# EAGLE schematic eib-256-nanoz-adapter (EAGLE 6.5.0)
DESIGNER: JPN@MIT; DESIGN_NAME: 2x64_hirose-circular; LICENSE: (c) Jon Newman CC-BY-SA-NC 4.0; REVISION: 1.0
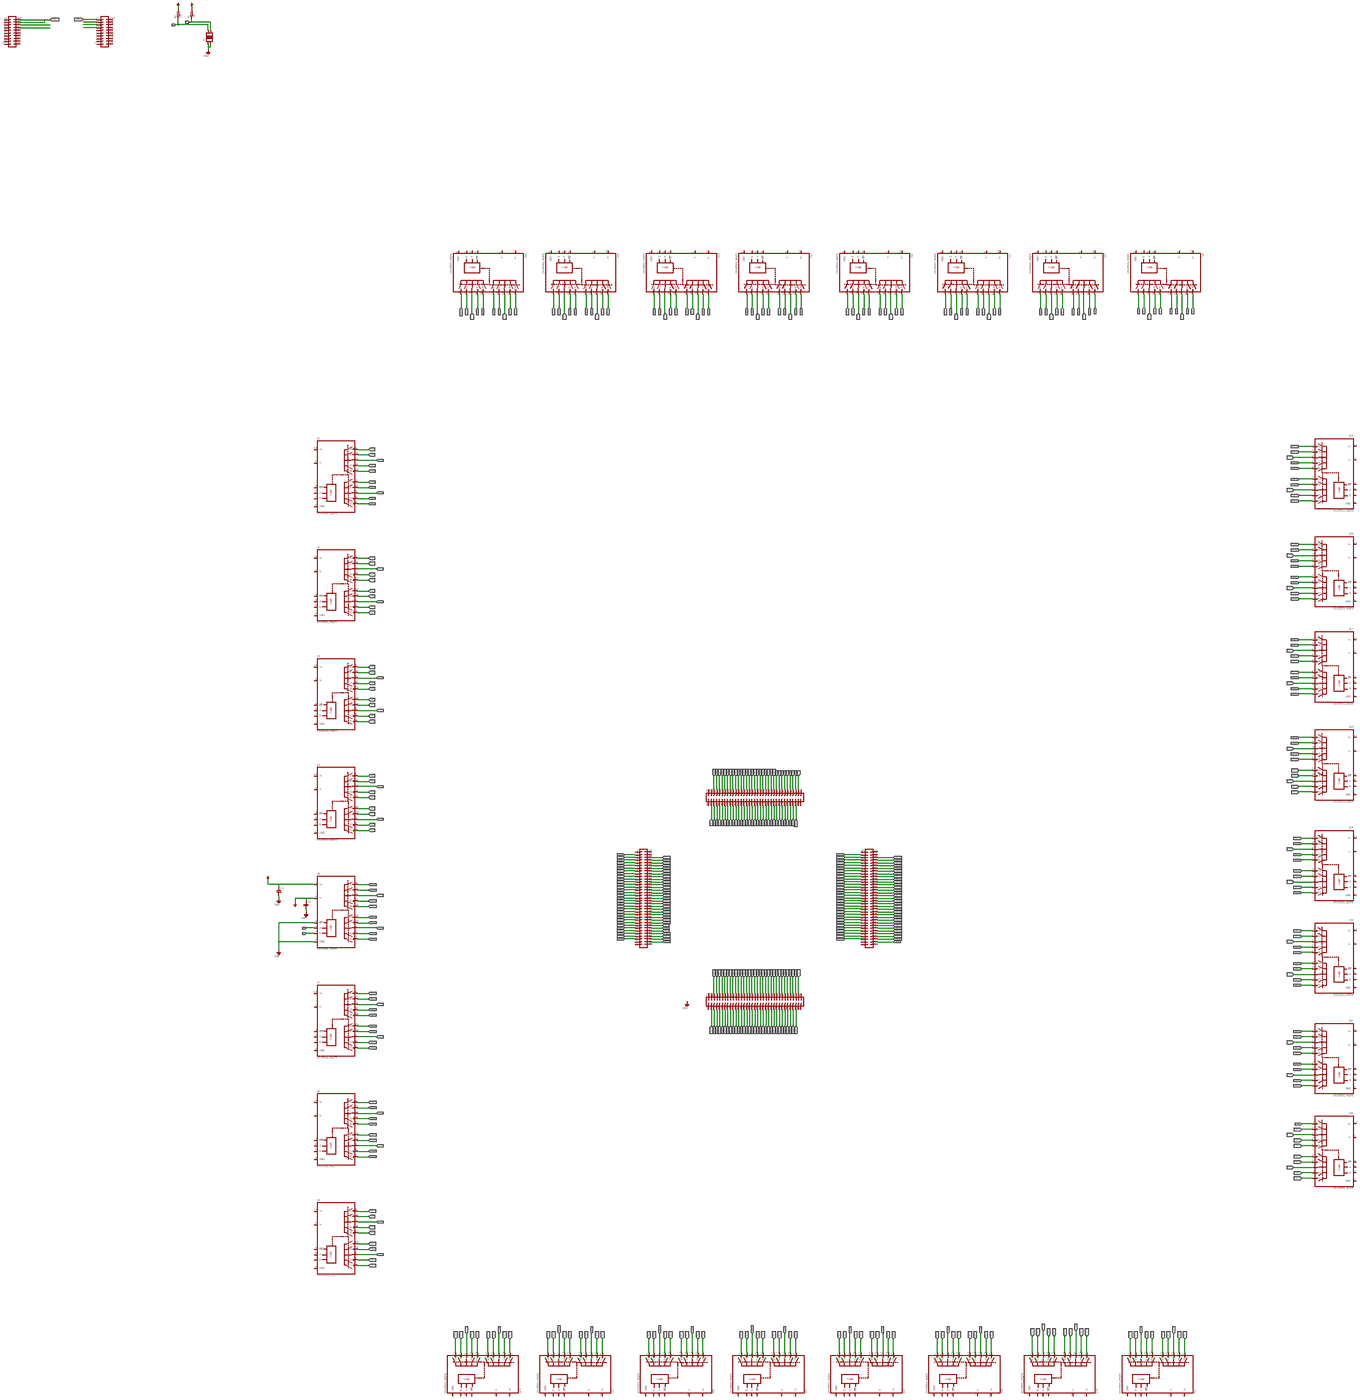
[diagram p0: schematic, sheet 1, overview]
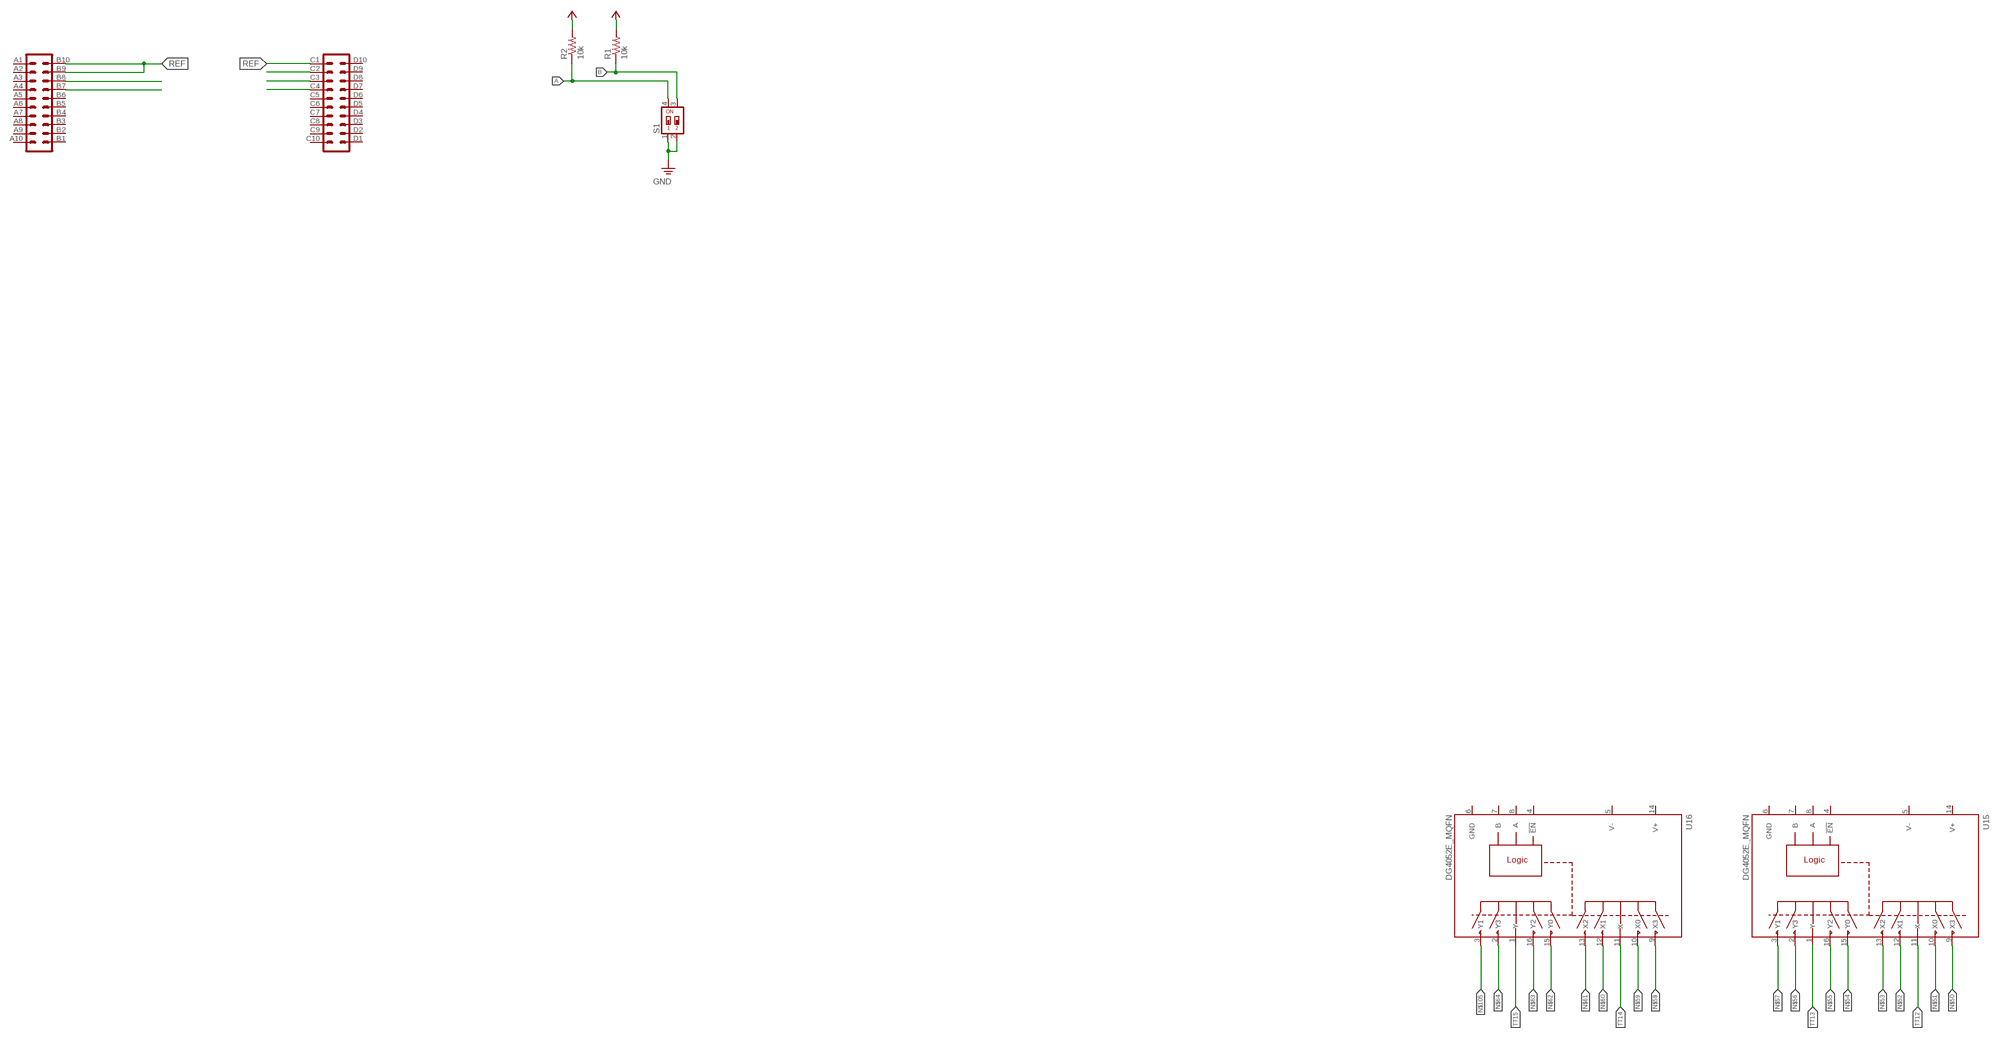
[diagram p1: schematic, sheet 1, part 1 of 8]
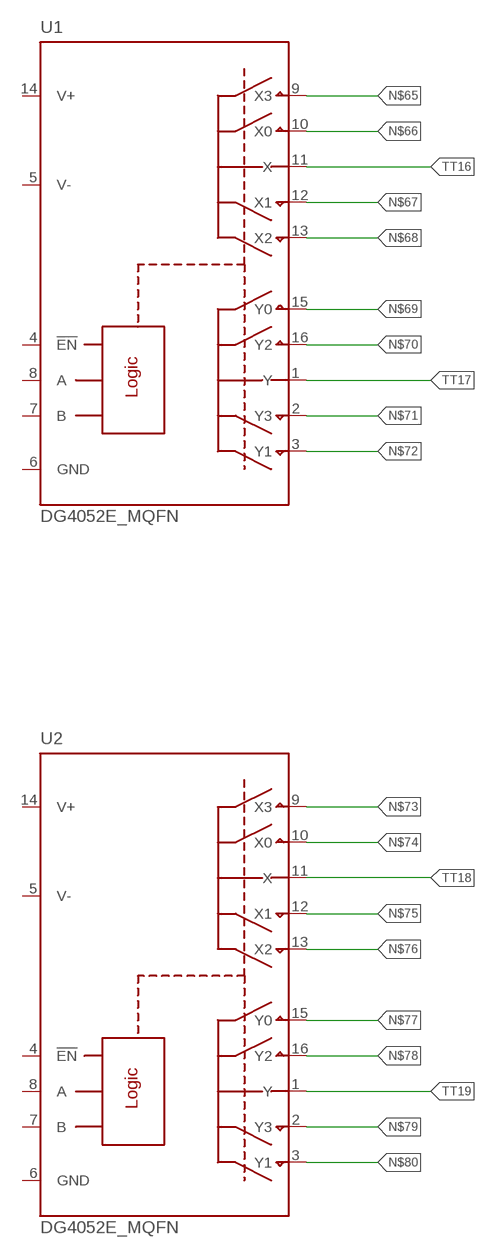
[diagram p2: schematic, sheet 1, part 2 of 8]
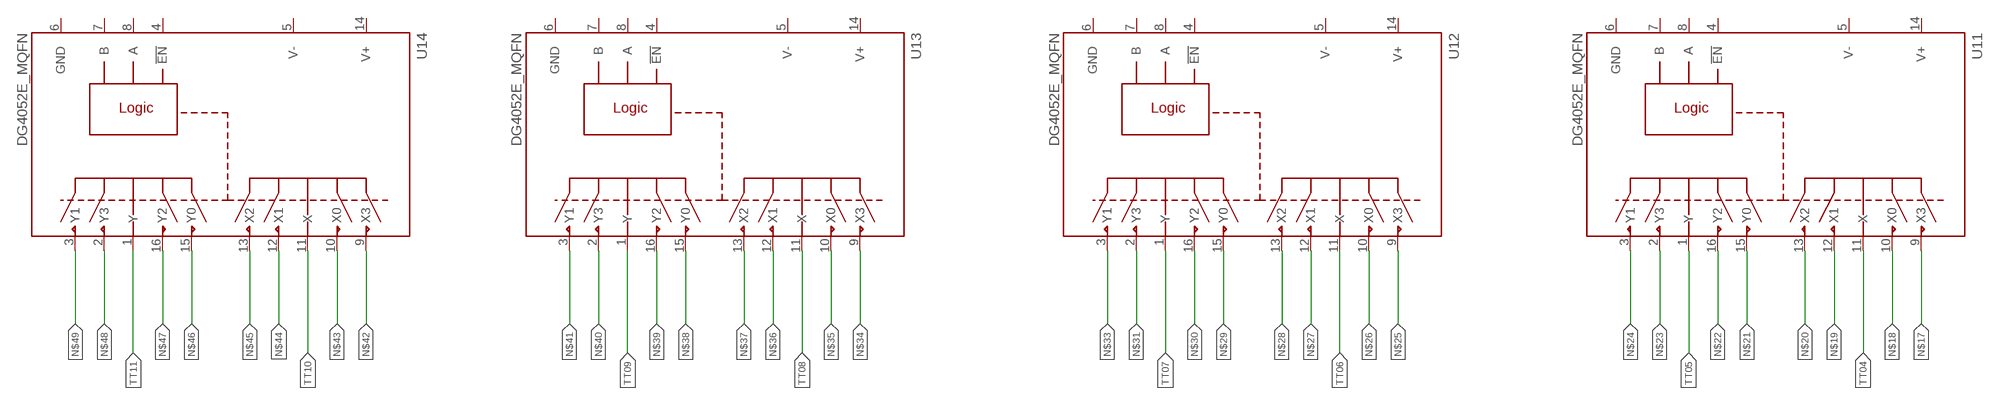
[diagram p3: schematic, sheet 1, part 3 of 8]
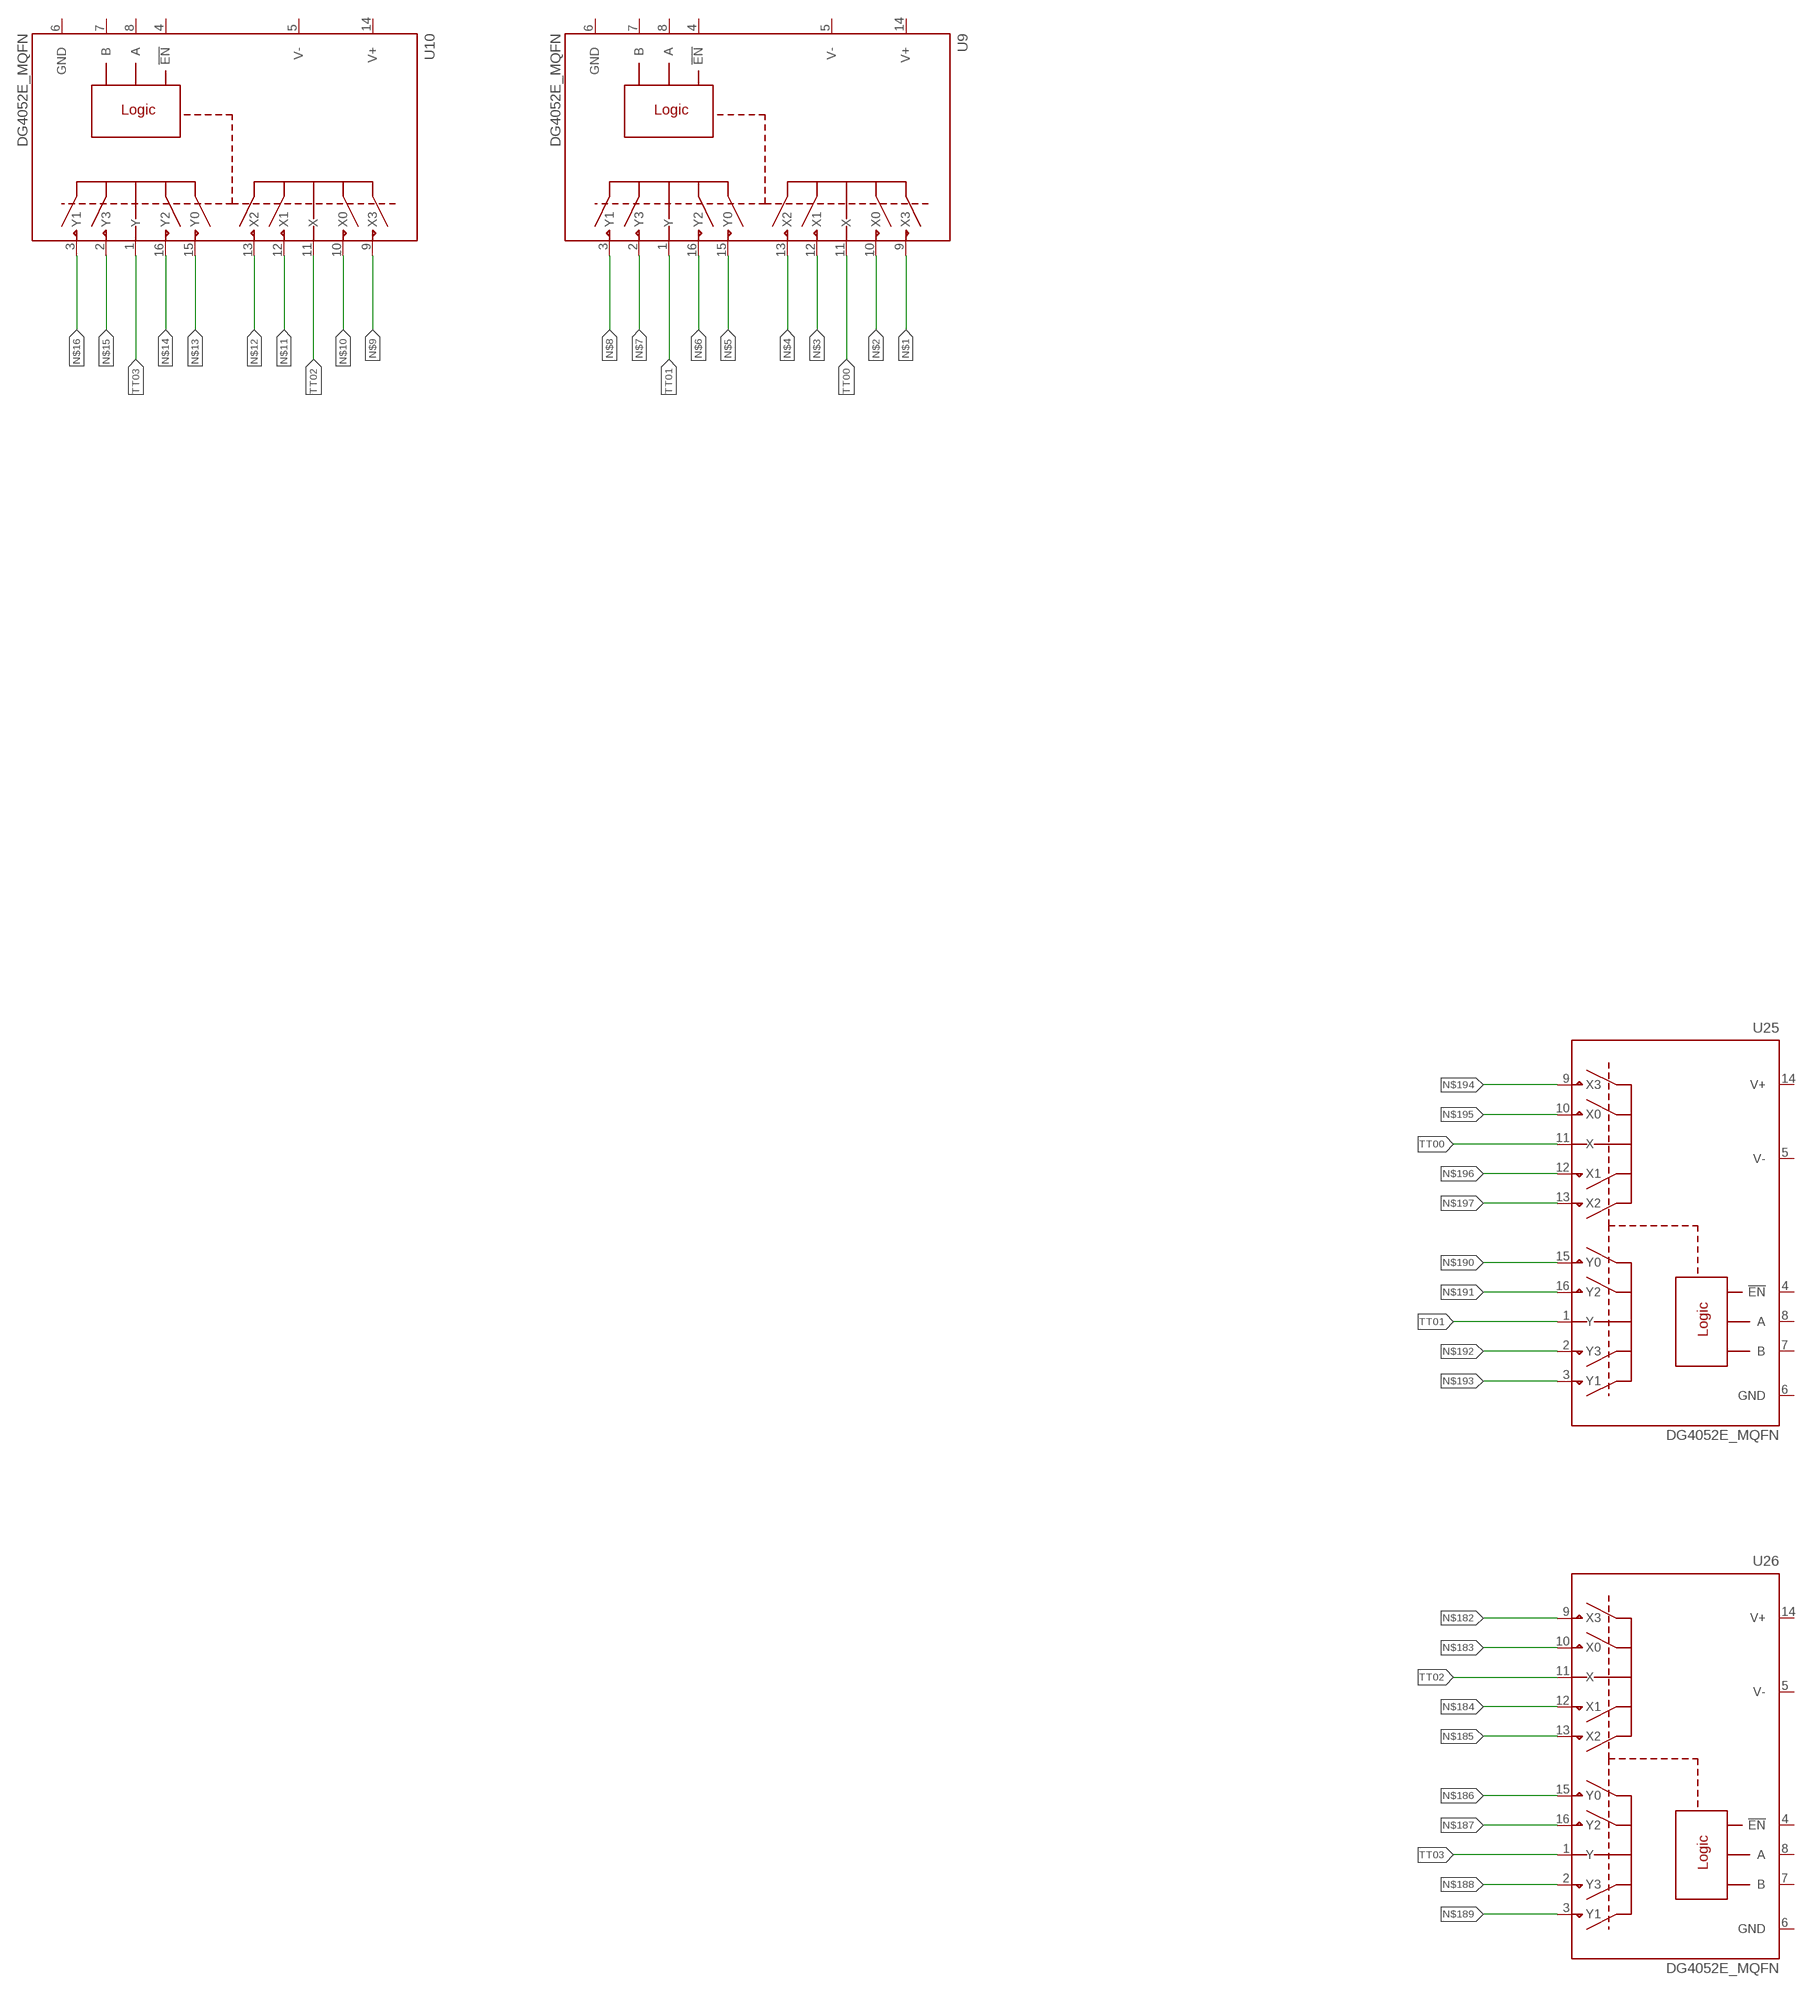
[diagram p4: schematic, sheet 1, part 4 of 8]
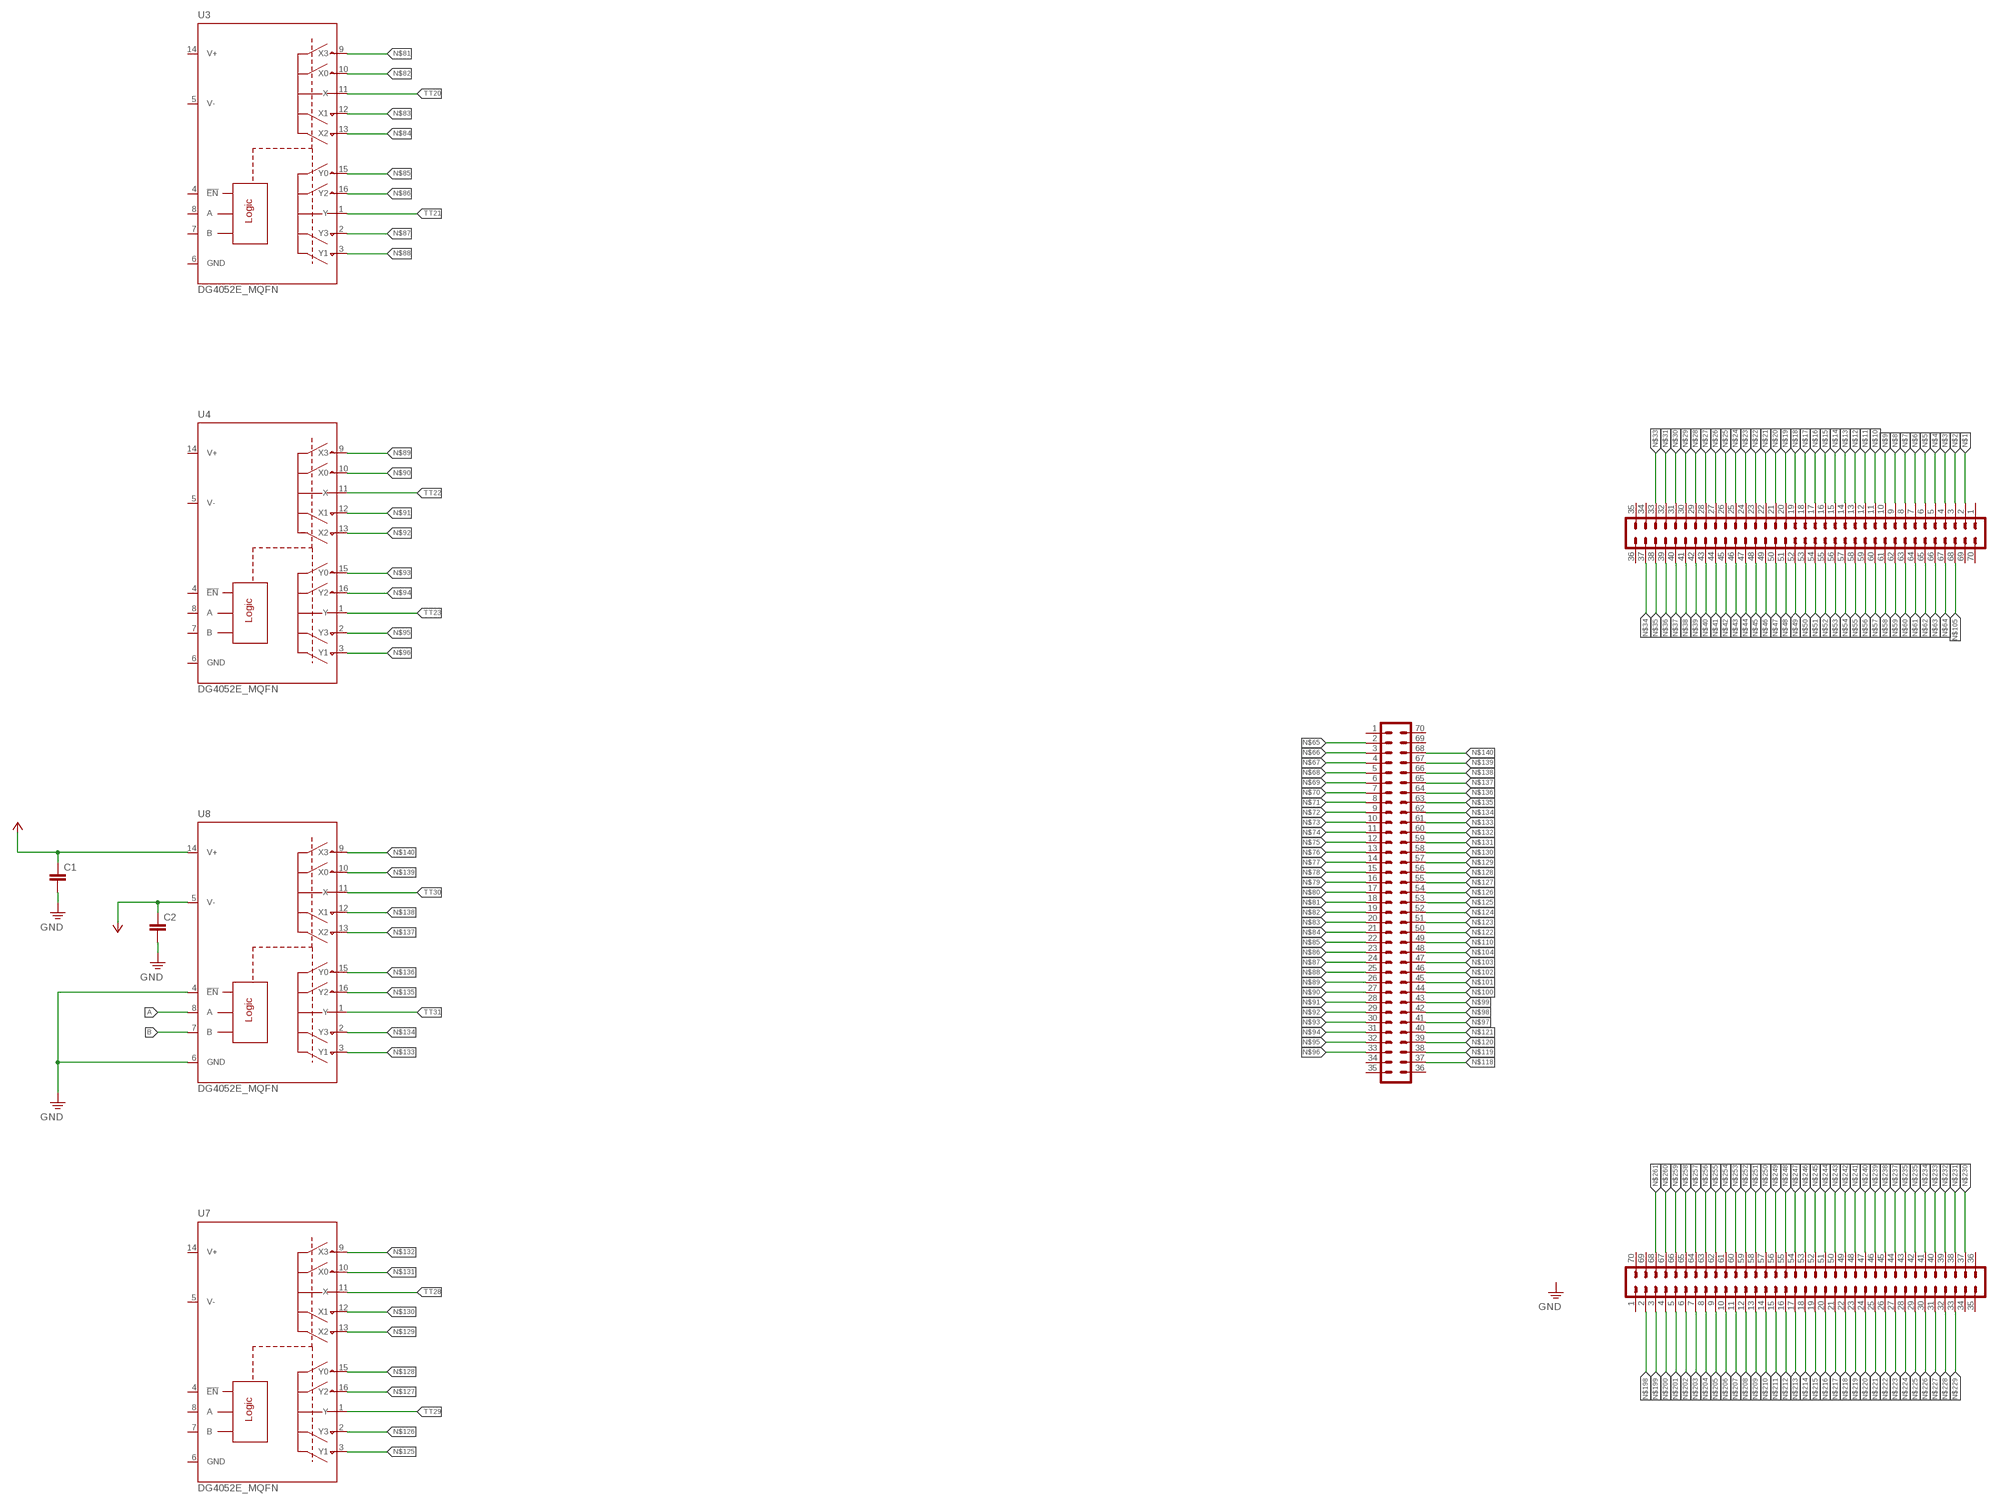
[diagram p5: schematic, sheet 1, part 5 of 8]
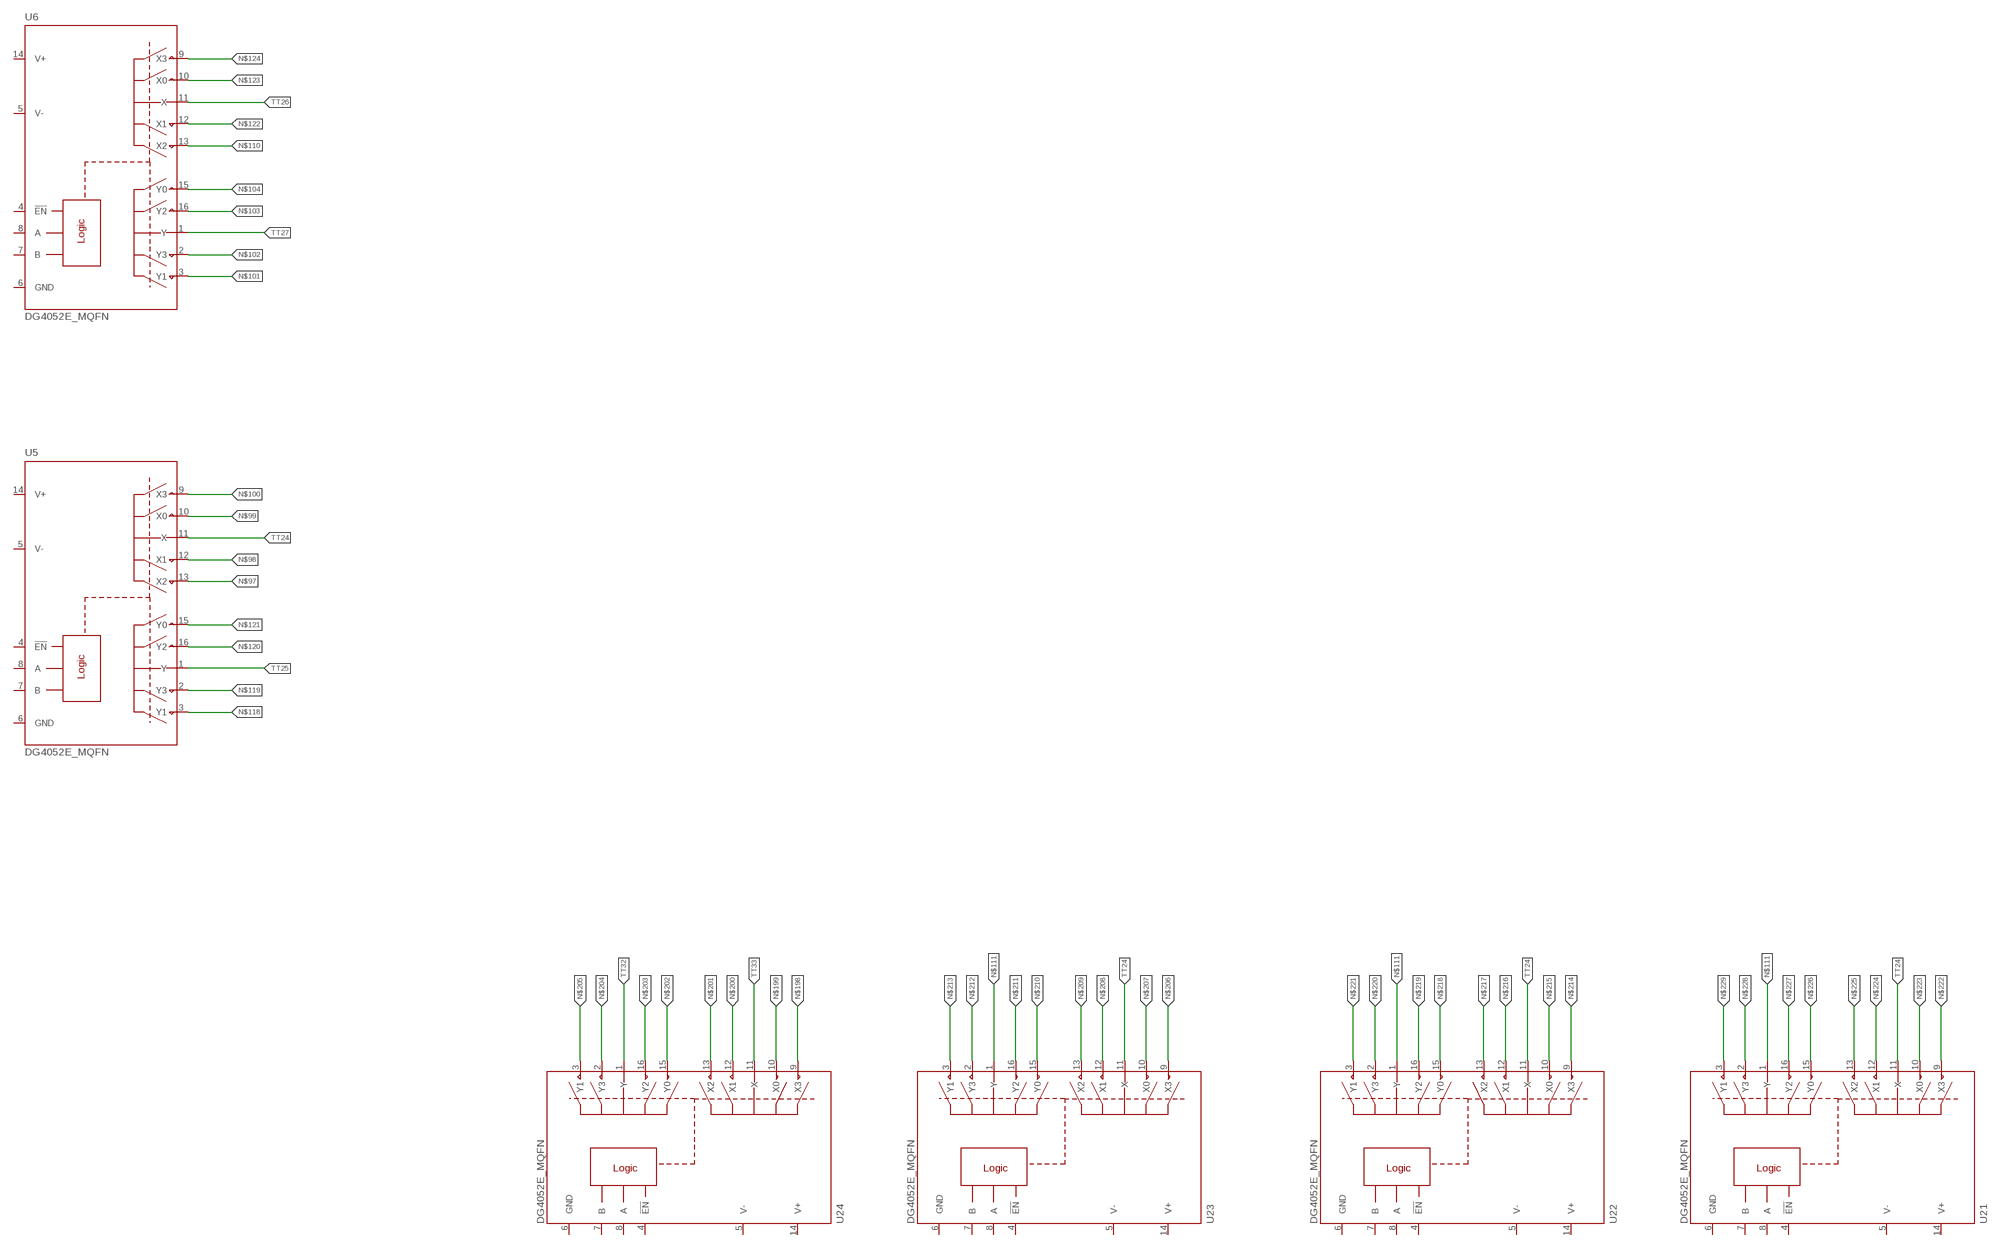
[diagram p6: schematic, sheet 1, part 6 of 8]
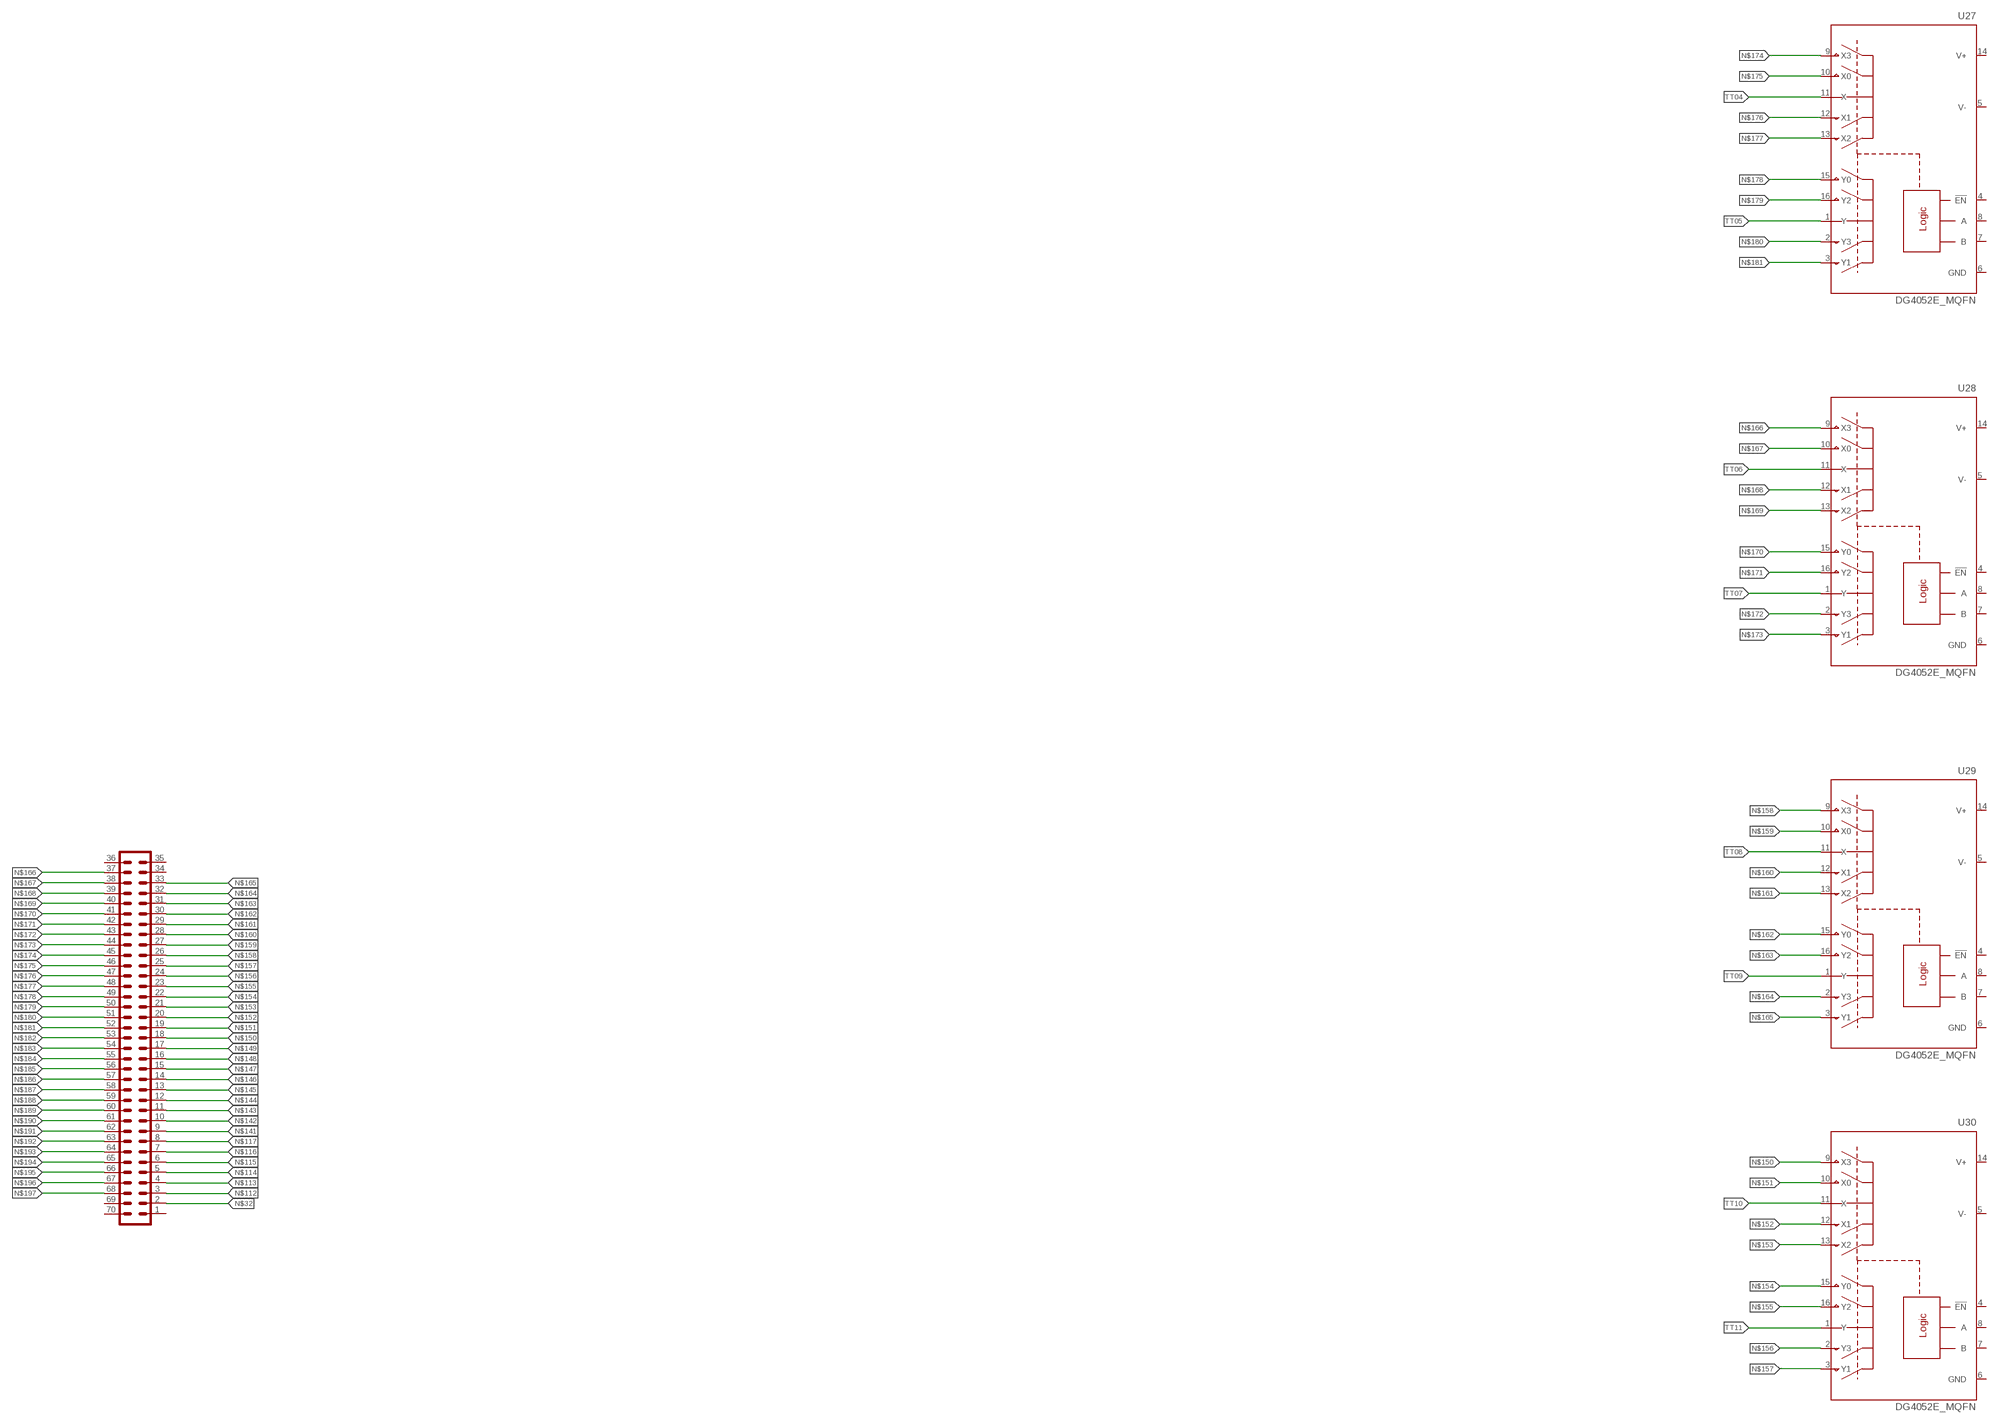
[diagram p7: schematic, sheet 1, part 7 of 8]
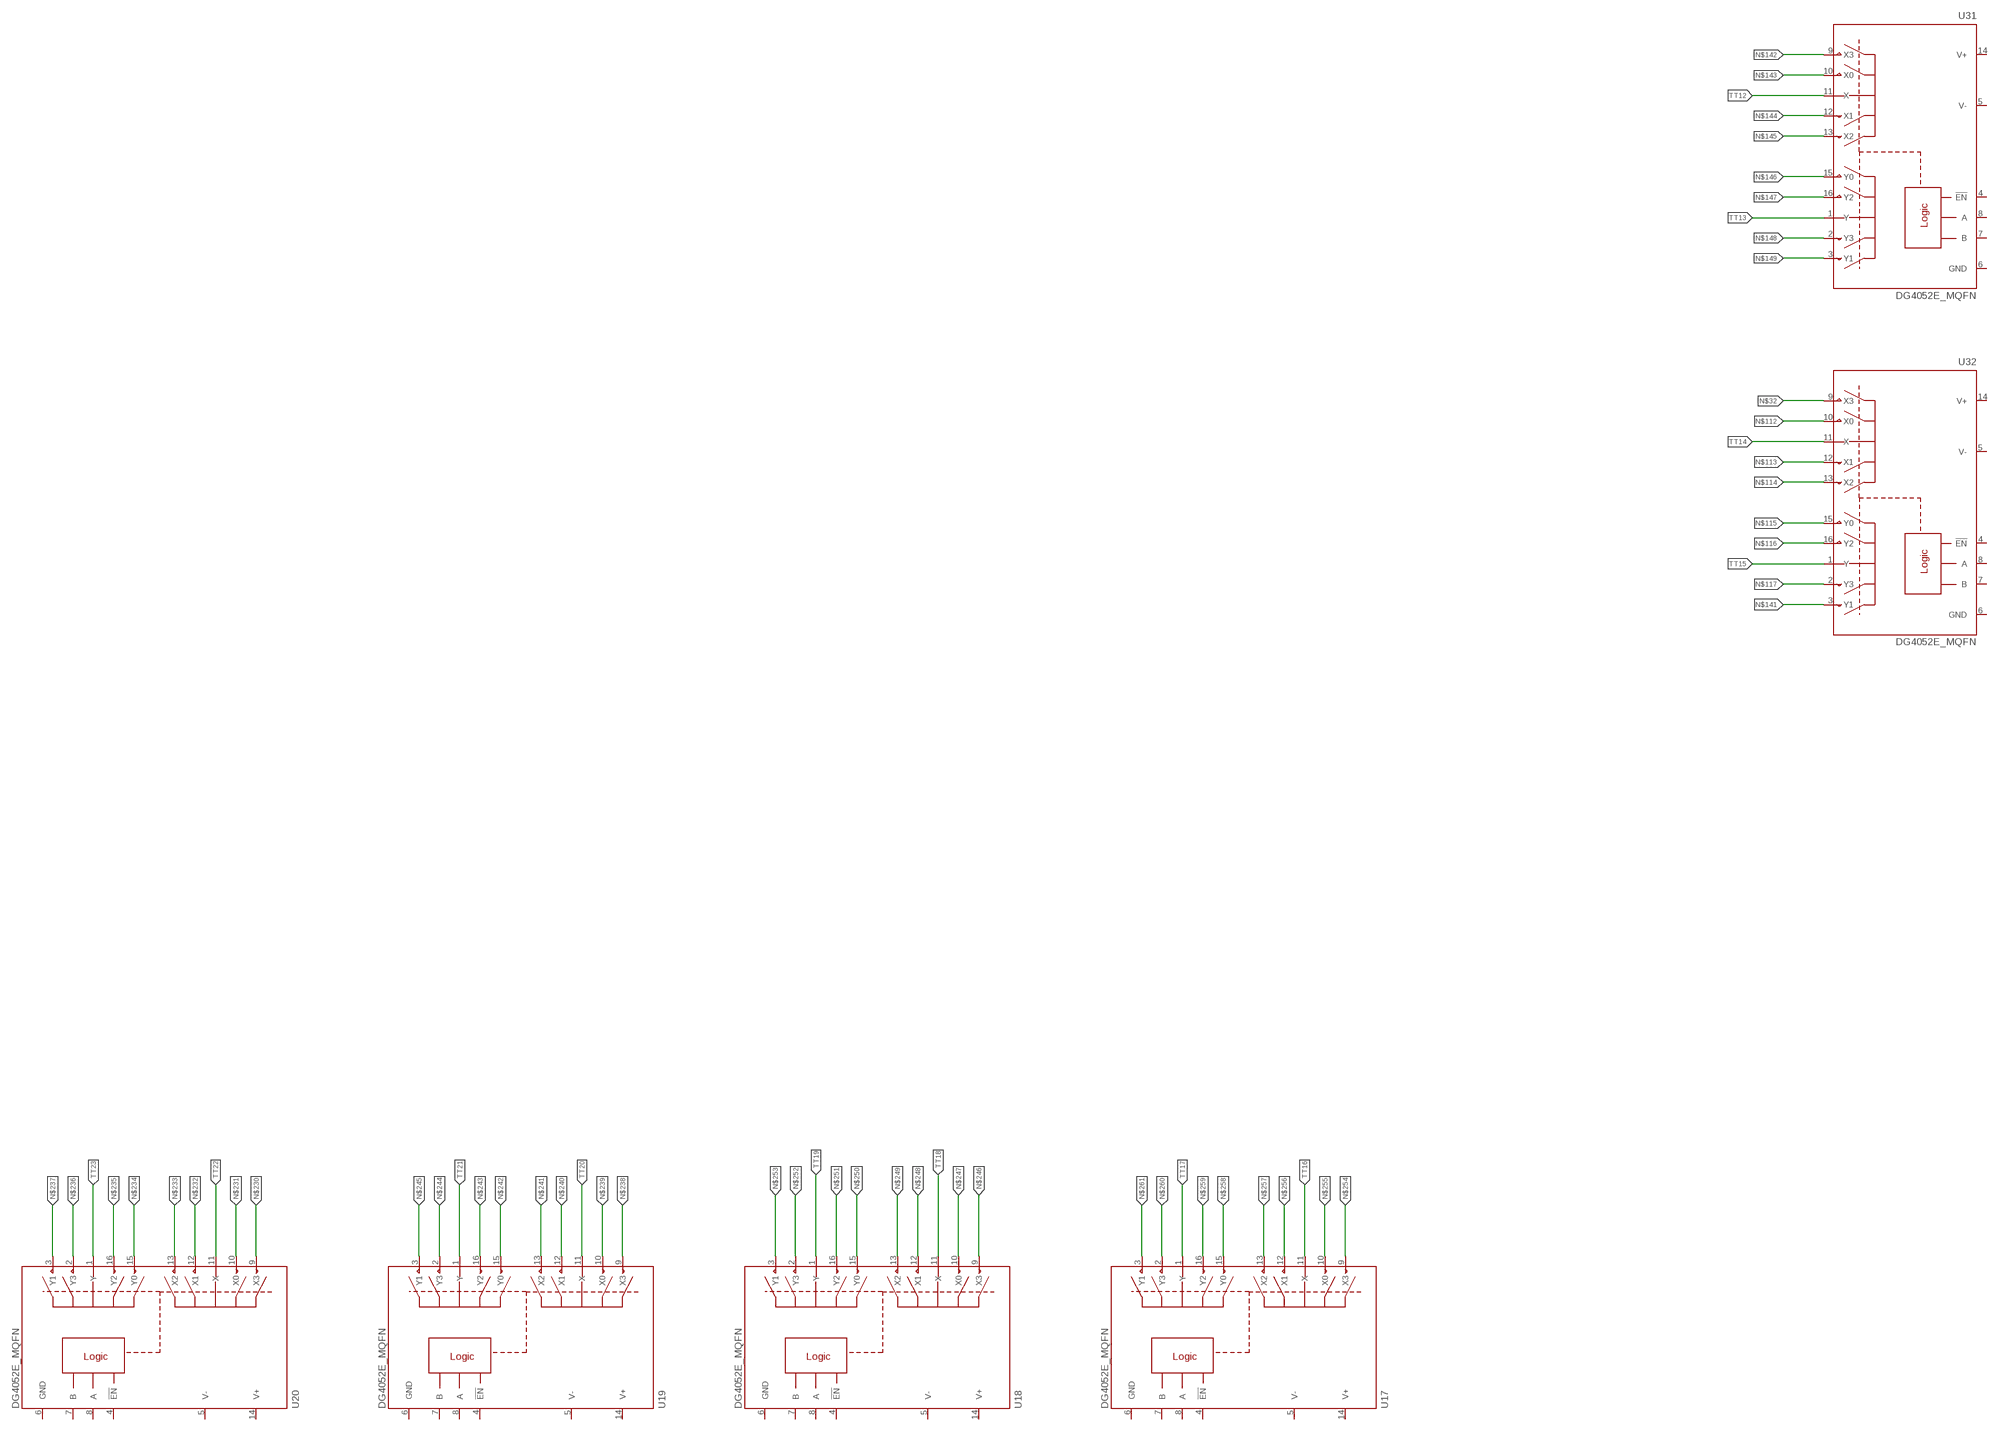
[diagram p8: schematic, sheet 1, part 8 of 8]

## Parts
$1_8_$  PINHD-4X10_MOLC-THRU  [MOLC-110-11-S-Q]
A  DF40HEAD  PINHD-2X35_DF40REC  [DF40-70REC]
B  DF40HEAD  PINHD-2X35_DF40REC  [DF40-70REC]
C  DF40HEAD  PINHD-2X35_DF40REC  [DF40-70REC]
C1  C_0402  [0402]
C2  C_0402  [0402]
D  DF40HEAD  PINHD-2X35_DF40REC  [DF40-70REC]
R1  10k  R_0603  [0603]
R2  10k  R_0603  [0603]
S1  DIPSW-002  [SMS-002]
U1  DG4052E_MQFN  [MQFN16-1.8X2.6]
U2  DG4052E_MQFN  [MQFN16-1.8X2.6]
U3  DG4052E_MQFN  [MQFN16-1.8X2.6]
U4  DG4052E_MQFN  [MQFN16-1.8X2.6]
U5  DG4052E_MQFN  [MQFN16-1.8X2.6]
U6  DG4052E_MQFN  [MQFN16-1.8X2.6]
U7  DG4052E_MQFN  [MQFN16-1.8X2.6]
U8  DG4052E_MQFN  [MQFN16-1.8X2.6]
U9  DG4052E_MQFN  [MQFN16-1.8X2.6]
U10  DG4052E_MQFN  [MQFN16-1.8X2.6]
U11  DG4052E_MQFN  [MQFN16-1.8X2.6]
U12  DG4052E_MQFN  [MQFN16-1.8X2.6]
U13  DG4052E_MQFN  [MQFN16-1.8X2.6]
U14  DG4052E_MQFN  [MQFN16-1.8X2.6]
U15  DG4052E_MQFN  [MQFN16-1.8X2.6]
U16  DG4052E_MQFN  [MQFN16-1.8X2.6]
U17  DG4052E_MQFN  [MQFN16-1.8X2.6]
U18  DG4052E_MQFN  [MQFN16-1.8X2.6]
U19  DG4052E_MQFN  [MQFN16-1.8X2.6]
U20  DG4052E_MQFN  [MQFN16-1.8X2.6]
U21  DG4052E_MQFN  [MQFN16-1.8X2.6]
U22  DG4052E_MQFN  [MQFN16-1.8X2.6]
U23  DG4052E_MQFN  [MQFN16-1.8X2.6]
U24  DG4052E_MQFN  [MQFN16-1.8X2.6]
U25  DG4052E_MQFN  [MQFN16-1.8X2.6]
U26  DG4052E_MQFN  [MQFN16-1.8X2.6]
U27  DG4052E_MQFN  [MQFN16-1.8X2.6]
U28  DG4052E_MQFN  [MQFN16-1.8X2.6]
U29  DG4052E_MQFN  [MQFN16-1.8X2.6]
U30  DG4052E_MQFN  [MQFN16-1.8X2.6]
U31  DG4052E_MQFN  [MQFN16-1.8X2.6]
U32  DG4052E_MQFN  [MQFN16-1.8X2.6]

## Nets
A: R2.1 S1.4 U8.8(A)
B: R1.1 S1.3 U8.7(B)
GND: C1.2 C2.2 S1.1 S1.2 U8.4(!EN) U8.6(GND)
N$1: A.2 U9.9(X3)
N$2: A.3 U9.10(X0)
N$3: A.4 U9.12(X1)
N$4: A.5 U9.13(X2)
N$5: A.6 U9.15(Y0)
N$6: A.7 U9.16(Y2)
N$7: A.8 U9.2(Y3)
N$8: A.9 U9.3(Y1)
N$9: A.10 U10.9(X3)
N$10: A.11 U10.10(X0)
N$11: A.12 U10.12(X1)
N$12: A.13 U10.13(X2)
N$13: A.14 U10.15(Y0)
N$14: A.15 U10.16(Y2)
N$15: A.16 U10.2(Y3)
N$16: A.17 U10.3(Y1)
N$17: A.18 U11.9(X3)
N$18: A.19 U11.10(X0)
N$19: A.20 U11.12(X1)
N$20: A.21 U11.13(X2)
N$21: A.22 U11.15(Y0)
N$22: A.23 U11.16(Y2)
N$23: A.24 U11.2(Y3)
N$24: A.25 U11.3(Y1)
N$25: A.26 U12.9(X3)
N$26: A.27 U12.10(X0)
N$27: A.28 U12.12(X1)
N$28: A.29 U12.13(X2)
N$29: A.30 U12.15(Y0)
N$30: A.31 U12.16(Y2)
N$31: A.32 U12.2(Y3)
N$32: D.2 U32.9(X3)
N$33: A.33 U12.3(Y1)
N$34: A.37 U13.9(X3)
N$35: A.38 U13.10(X0)
N$36: A.39 U13.12(X1)
N$37: A.40 U13.13(X2)
N$38: A.41 U13.15(Y0)
N$39: A.42 U13.16(Y2)
N$40: A.43 U13.2(Y3)
N$41: A.44 U13.3(Y1)
N$42: A.45 U14.9(X3)
N$43: A.46 U14.10(X0)
N$44: A.47 U14.12(X1)
N$45: A.48 U14.13(X2)
N$46: A.49 U14.15(Y0)
N$47: A.50 U14.16(Y2)
N$48: A.51 U14.2(Y3)
N$49: A.52 U14.3(Y1)
N$50: A.53 U15.9(X3)
N$51: A.54 U15.10(X0)
N$52: A.55 U15.12(X1)
N$53: A.56 U15.13(X2)
N$54: A.57 U15.15(Y0)
N$55: A.58 U15.16(Y2)
N$56: A.59 U15.2(Y3)
N$57: A.60 U15.3(Y1)
N$58: A.61 U16.9(X3)
N$59: A.62 U16.10(X0)
N$60: A.63 U16.12(X1)
N$61: A.64 U16.13(X2)
N$62: A.65 U16.15(Y0)
N$63: A.66 U16.16(Y2)
N$64: A.67 U16.2(Y3)
N$65: C.2 U1.9(X3)
N$66: C.3 U1.10(X0)
N$67: C.4 U1.12(X1)
N$68: C.5 U1.13(X2)
N$69: C.6 U1.15(Y0)
N$70: C.7 U1.16(Y2)
N$71: C.8 U1.2(Y3)
N$72: C.9 U1.3(Y1)
N$73: C.10 U2.9(X3)
N$74: C.11 U2.10(X0)
N$75: C.12 U2.12(X1)
N$76: C.13 U2.13(X2)
N$77: C.14 U2.15(Y0)
N$78: C.15 U2.16(Y2)
N$79: C.16 U2.2(Y3)
N$80: C.17 U2.3(Y1)
N$81: C.18 U3.9(X3)
N$82: C.19 U3.10(X0)
N$83: C.20 U3.12(X1)
N$84: C.21 U3.13(X2)
N$85: C.22 U3.15(Y0)
N$86: C.23 U3.16(Y2)
N$87: C.24 U3.2(Y3)
N$88: C.25 U3.3(Y1)
N$89: C.26 U4.9(X3)
N$90: C.27 U4.10(X0)
N$91: C.28 U4.12(X1)
N$92: C.29 U4.13(X2)
N$93: C.30 U4.15(Y0)
N$94: C.31 U4.16(Y2)
N$95: C.32 U4.2(Y3)
N$96: C.33 U4.3(Y1)
N$97: C.41 U5.13(X2)
N$98: C.42 U5.12(X1)
N$99: C.43 U5.10(X0)
N$100: C.44 U5.9(X3)
N$101: C.45 U6.3(Y1)
N$102: C.46 U6.2(Y3)
N$103: C.47 U6.16(Y2)
N$104: C.48 U6.15(Y0)
N$105: A.68 U16.3(Y1)
N$106: $1_8_$.B7
N$107: $1_8_$.C2
N$108: $1_8_$.C3
N$109: $1_8_$.C4
N$110: C.49 U6.13(X2)
N$111: U21.1(Y) U22.1(Y) U23.1(Y)
N$112: D.3 U32.10(X0)
N$113: D.4 U32.12(X1)
N$114: D.5 U32.13(X2)
N$115: D.6 U32.15(Y0)
N$116: D.7 U32.16(Y2)
N$117: D.8 U32.2(Y3)
N$118: C.37 U5.3(Y1)
N$119: C.38 U5.2(Y3)
N$120: C.39 U5.16(Y2)
N$121: C.40 U5.15(Y0)
N$122: C.50 U6.12(X1)
N$123: C.51 U6.10(X0)
N$124: C.52 U6.9(X3)
N$125: C.53 U7.3(Y1)
N$126: C.54 U7.2(Y3)
N$127: C.55 U7.16(Y2)
N$128: C.56 U7.15(Y0)
N$129: C.57 U7.13(X2)
N$130: C.58 U7.12(X1)
N$131: C.59 U7.10(X0)
N$132: C.60 U7.9(X3)
N$133: C.61 U8.3(Y1)
N$134: C.62 U8.2(Y3)
N$135: C.63 U8.16(Y2)
N$136: C.64 U8.15(Y0)
N$137: C.65 U8.13(X2)
N$138: C.66 U8.12(X1)
N$139: C.67 U8.10(X0)
N$140: C.68 U8.9(X3)
N$141: D.9 U32.3(Y1)
N$142: D.10 U31.9(X3)
N$143: D.11 U31.10(X0)
N$144: D.12 U31.12(X1)
N$145: D.13 U31.13(X2)
N$146: D.14 U31.15(Y0)
N$147: D.15 U31.16(Y2)
N$148: D.16 U31.2(Y3)
N$149: D.17 U31.3(Y1)
N$150: D.18 U30.9(X3)
N$151: D.19 U30.10(X0)
N$152: D.20 U30.12(X1)
N$153: D.21 U30.13(X2)
N$154: D.22 U30.15(Y0)
N$155: D.23 U30.16(Y2)
N$156: D.24 U30.2(Y3)
N$157: D.25 U30.3(Y1)
N$158: D.26 U29.9(X3)
N$159: D.27 U29.10(X0)
N$160: D.28 U29.12(X1)
N$161: D.29 U29.13(X2)
N$162: D.30 U29.15(Y0)
N$163: D.31 U29.16(Y2)
N$164: D.32 U29.2(Y3)
N$165: D.33 U29.3(Y1)
N$166: D.37 U28.9(X3)
N$167: D.38 U28.10(X0)
N$168: D.39 U28.12(X1)
N$169: D.40 U28.13(X2)
N$170: D.41 U28.15(Y0)
N$171: D.42 U28.16(Y2)
N$172: D.43 U28.2(Y3)
N$173: D.44 U28.3(Y1)
N$174: D.45 U27.9(X3)
N$175: D.46 U27.10(X0)
N$176: D.47 U27.12(X1)
N$177: D.48 U27.13(X2)
N$178: D.49 U27.15(Y0)
N$179: D.50 U27.16(Y2)
N$180: D.51 U27.2(Y3)
N$181: D.52 U27.3(Y1)
N$182: D.53 U26.9(X3)
N$183: D.54 U26.10(X0)
N$184: D.55 U26.12(X1)
N$185: D.56 U26.13(X2)
N$186: D.57 U26.15(Y0)
N$187: D.58 U26.16(Y2)
N$188: D.59 U26.2(Y3)
N$189: D.60 U26.3(Y1)
N$190: D.61 U25.15(Y0)
N$191: D.62 U25.16(Y2)
N$192: D.63 U25.2(Y3)
N$193: D.64 U25.3(Y1)
N$194: D.65 U25.9(X3)
N$195: D.66 U25.10(X0)
N$196: D.67 U25.12(X1)
N$197: D.68 U25.13(X2)
N$198: B.2 U24.9(X3)
N$199: B.3 U24.10(X0)
N$200: B.4 U24.12(X1)
N$201: B.5 U24.13(X2)
N$202: B.6 U24.15(Y0)
N$203: B.7 U24.16(Y2)
N$204: B.8 U24.2(Y3)
N$205: B.9 U24.3(Y1)
N$206: B.10 U23.9(X3)
N$207: B.11 U23.10(X0)
N$208: B.12 U23.12(X1)
N$209: B.13 U23.13(X2)
N$210: B.14 U23.15(Y0)
N$211: B.15 U23.16(Y2)
N$212: B.16 U23.2(Y3)
N$213: B.17 U23.3(Y1)
N$214: B.18 U22.9(X3)
N$215: B.19 U22.10(X0)
N$216: B.20 U22.12(X1)
N$217: B.21 U22.13(X2)
N$218: B.22 U22.15(Y0)
N$219: B.23 U22.16(Y2)
N$220: B.24 U22.2(Y3)
N$221: B.25 U22.3(Y1)
N$222: B.26 U21.9(X3)
N$223: B.27 U21.10(X0)
N$224: B.28 U21.12(X1)
N$225: B.29 U21.13(X2)
N$226: B.30 U21.15(Y0)
N$227: B.31 U21.16(Y2)
N$228: B.32 U21.2(Y3)
N$229: B.33 U21.3(Y1)
N$230: B.37 U20.9(X3)
N$231: B.38 U20.10(X0)
N$232: B.39 U20.12(X1)
N$233: B.40 U20.13(X2)
N$234: B.41 U20.15(Y0)
N$235: B.42 U20.16(Y2)
N$236: B.43 U20.2(Y3)
N$237: B.44 U20.3(Y1)
N$238: B.45 U19.9(X3)
N$239: B.46 U19.10(X0)
N$240: B.47 U19.12(X1)
N$241: B.48 U19.13(X2)
N$242: B.49 U19.15(Y0)
N$243: B.50 U19.16(Y2)
N$244: B.51 U19.2(Y3)
N$245: B.52 U19.3(Y1)
N$246: B.53 U18.9(X3)
N$247: B.54 U18.10(X0)
N$248: B.55 U18.12(X1)
N$249: B.56 U18.13(X2)
N$250: B.57 U18.15(Y0)
N$251: B.58 U18.16(Y2)
N$252: B.59 U18.2(Y3)
N$253: B.60 U18.3(Y1)
N$254: B.61 U17.9(X3)
N$255: B.62 U17.10(X0)
N$256: B.63 U17.12(X1)
N$257: B.64 U17.13(X2)
N$258: B.65 U17.15(Y0)
N$259: B.66 U17.16(Y2)
N$260: B.67 U17.2(Y3)
N$261: B.68 U17.3(Y1)
NC: $1_8_$.B8
REF: $1_8_$.B9 $1_8_$.B10 $1_8_$.C1
TT00: U9.11(X) U25.11(X)
TT01: U9.1(Y) U25.1(Y)
TT02: U10.11(X) U26.11(X)
TT03: U10.1(Y) U26.1(Y)
TT04: U11.11(X) U27.11(X)
TT05: U11.1(Y) U27.1(Y)
TT06: U12.11(X) U28.11(X)
TT07: U12.1(Y) U28.1(Y)
TT08: U13.11(X) U29.11(X)
TT09: U13.1(Y) U29.1(Y)
TT10: U14.11(X) U30.11(X)
TT11: U14.1(Y) U30.1(Y)
TT12: U15.11(X) U31.11(X)
TT13: U15.1(Y) U31.1(Y)
TT14: U16.11(X) U32.11(X)
TT15: U16.1(Y) U32.1(Y)
TT16: U1.11(X) U17.11(X)
TT17: U1.1(Y) U17.1(Y)
TT18: U2.11(X) U18.11(X)
TT19: U2.1(Y) U18.1(Y)
TT20: U3.11(X) U19.11(X)
TT21: U3.1(Y) U19.1(Y)
TT22: U4.11(X) U20.11(X)
TT23: U4.1(Y) U20.1(Y)
TT24: U5.11(X) U21.11(X) U22.11(X) U23.11(X)
TT25: U5.1(Y)
TT26: U6.11(X)
TT27: U6.1(Y)
TT28: U7.11(X)
TT29: U7.1(Y)
TT30: U8.11(X)
TT31: U8.1(Y)
TT32: U24.1(Y)
TT33: U24.11(X)
VCC: C1.1 R1.2 R2.2 U8.14(V+)
VSS: C2.1 U8.5(V-)
Unconnected: $1_8_$.A1 $1_8_$.A2 $1_8_$.A3 $1_8_$.A4 $1_8_$.A5 $1_8_$.A6 $1_8_$.A7 $1_8_$.A8 $1_8_$.A9 $1_8_$.A10 $1_8_$.B1 $1_8_$.B2 $1_8_$.B3 $1_8_$.B4 $1_8_$.B5 $1_8_$.B6 $1_8_$.C5 $1_8_$.C6 $1_8_$.C7 $1_8_$.C8 $1_8_$.C9 $1_8_$.C10 $1_8_$.D1 $1_8_$.D2 $1_8_$.D3 $1_8_$.D4 $1_8_$.D5 $1_8_$.D6 $1_8_$.D7 $1_8_$.D8 $1_8_$.D9 $1_8_$.D10 A.1 A.34 A.35 A.36 A.69 A.70 B.1 B.34 B.35 B.36 B.69 B.70 C.1 C.34 C.35 C.36 C.69 C.70 D.1 D.34 D.35 D.36 D.69 D.70 U1.4(!EN) U1.7(B) U1.8(A) U1.14(V+) U2.4(!EN) U2.7(B) U2.8(A) U2.14(V+) U3.4(!EN) U3.7(B) U3.8(A) U3.14(V+) U4.4(!EN) U4.7(B) U4.8(A) U4.14(V+) U5.4(!EN) U5.7(B) U5.8(A) U5.14(V+) U6.4(!EN) U6.7(B) U6.8(A) U6.14(V+) U7.4(!EN) U7.7(B) U7.8(A) U7.14(V+) U9.4(!EN) U9.7(B) U9.8(A) U9.14(V+) U10.4(!EN) U10.7(B) U10.8(A) U10.14(V+) U11.4(!EN) U11.7(B) U11.8(A) U11.14(V+) U12.4(!EN) U12.7(B) U12.8(A) U12.14(V+) U13.4(!EN) U13.7(B) U13.8(A) U13.14(V+) U14.4(!EN) U14.7(B) U14.8(A) U14.14(V+) U15.4(!EN) U15.7(B) U15.8(A) U15.14(V+) U16.4(!EN) U16.7(B) U16.8(A) U16.14(V+) U17.4(!EN) U17.7(B) U17.8(A) U17.14(V+) U18.4(!EN) U18.7(B) U18.8(A) U18.14(V+) U19.4(!EN) U19.7(B) U19.8(A) U19.14(V+) U20.4(!EN) U20.7(B) U20.8(A) U20.14(V+) U21.4(!EN) U21.7(B) U21.8(A) U21.14(V+) U22.4(!EN) U22.7(B) U22.8(A) U22.14(V+) U23.4(!EN) U23.7(B) U23.8(A) U23.14(V+) U24.4(!EN) U24.7(B) U24.8(A) U24.14(V+) U25.4(!EN) U25.7(B) U25.8(A) U25.14(V+) U26.4(!EN) U26.7(B) U26.8(A) U26.14(V+) U27.4(!EN) U27.7(B) U27.8(A) U27.14(V+) U28.4(!EN) U28.7(B) U28.8(A) U28.14(V+) U29.4(!EN) U29.7(B) U29.8(A) U29.14(V+) U30.4(!EN) U30.7(B) U30.8(A) U30.14(V+) U31.4(!EN) U31.7(B) U31.8(A) U31.14(V+) U32.4(!EN) U32.7(B) U32.8(A) U32.14(V+)

## Power pins joined to a net without a drawn wire
GND: U1.6(GND) U2.6(GND) U3.6(GND) U4.6(GND) U5.6(GND) U6.6(GND) U7.6(GND) U9.6(GND) U10.6(GND) U11.6(GND) U12.6(GND) U13.6(GND) U14.6(GND) U15.6(GND) U16.6(GND) U17.6(GND) U18.6(GND) U19.6(GND) U20.6(GND) U21.6(GND) U22.6(GND) U23.6(GND) U24.6(GND) U25.6(GND) U26.6(GND) U27.6(GND) U28.6(GND) U29.6(GND) U30.6(GND) U31.6(GND) U32.6(GND)
V-: U1.5(V-) U2.5(V-) U3.5(V-) U4.5(V-) U5.5(V-) U6.5(V-) U7.5(V-) U9.5(V-) U10.5(V-) U11.5(V-) U12.5(V-) U13.5(V-) U14.5(V-) U15.5(V-) U16.5(V-) U17.5(V-) U18.5(V-) U19.5(V-) U20.5(V-) U21.5(V-) U22.5(V-) U23.5(V-) U24.5(V-) U25.5(V-) U26.5(V-) U27.5(V-) U28.5(V-) U29.5(V-) U30.5(V-) U31.5(V-) U32.5(V-)

## Library data of the parts
$1_8_$ = jonnew:PINHD-4X10
A B C D = jonnew:PINHD-2X35
C1 C2 = jonnew:C: Capacitor
R1 R2 = jonnew:R: Resistor; DK: PxxxxHTR-ND; MN: Panasonic; MPN: ERJ-3EKFxxxxV
S1 = jonnew:DIPSW-002: Dip Switch 2 pol.
U1-U32 = jonnew:DG4052E

## Net classes
1 thick: width 0.102 mm